# EAGLE design STM32L441CE_4L (EAGLE 9.6.2)

## Sheet 1 of 2
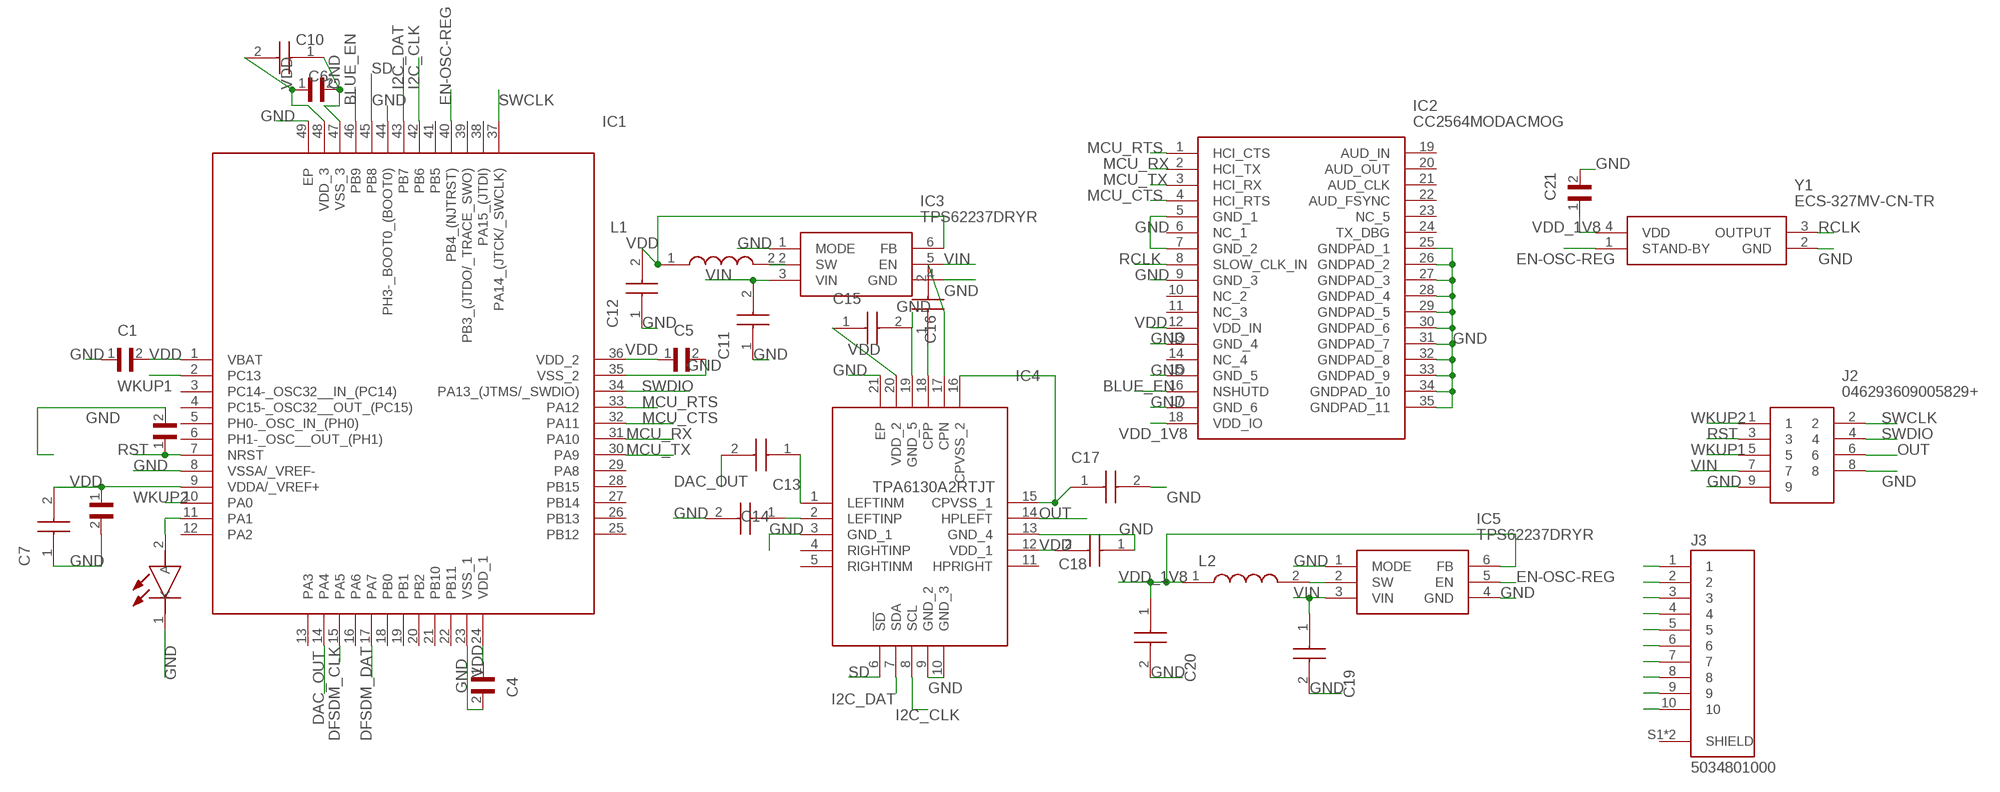
[diagram p0: schematic, sheet 1]

### Parts
C1  GRM033C80J104KE15D  [CAPC0603X33N]
C2  GRM033C80J104KE15D  [CAPC0603X33N]
C3  GRM033C80J104KE15D  [CAPC0603X33N]
C4  GRM033C80J104KE15D  [CAPC0603X33N]
C5  GRM033C80J104KE15D  [CAPC0603X33N]
C6  GRM033C80J104KE15D  [CAPC0603X33N]
C7  AMK063AC6105KP-F  [CAPC0603X33N]
C10  GRM035R60J475ME15D  [CAPC0603X55N]
C11  02016D225MAT2A  [CAPC0603X33N]
C12  GRM035R60J475ME15D  [CAPC0603X55N]
C13  CL03A474KQ3NNNC  [CAPC0603X33N]
C14  CL03A474KQ3NNNC  [CAPC0603X33N]
C15  AMK063AC6105KP-F  [CAPC0603X33N]
C16  AMK063AC6105KP-F  [CAPC0603X33N]
C17  AMK063AC6105KP-F  [CAPC0603X33N]
C18  AMK063AC6105KP-F  [CAPC0603X33N]
C19  02016D225MAT2A  [CAPC0603X33N]
C20  GRM035R60J475ME15D  [CAPC0603X55N]
C21  GRM033C80J104KE15D  [CAPC0603X33N]
IC1  STM32L451CEU6  [QFN50P700X700X60-49N]
IC2  CC2564MODACMOG  [MOG0035A]
IC3  TPS62237DRYR  [SON50P100X145X60-6N]
IC4  TPA6130A2RTJT  [QFN50P400X400X80-21N]
IC5  TPS62237DRYR  [SON50P100X145X60-6N]
J2  046293609005829+  [046293609005829]
J3  5034801000  [MOLEX_5034801000]
L1  MLZ1005M2R2WT000  [INDC1005X55N]
L2  MLZ1005M2R2WT000  [INDC1005X55N]
LED1  VLMS1500-GS08  [VLMG1500GS08]
Y1  ECS-327MV-CN-TR  [ECS327MVCNTR]

### Nets
BLUE_EN: IC1.46(PB9) IC2.16(NSHUTD)
DAC_OUT: C13.2 IC1.14(PA4)
DFSDM_CLK: IC1.15(PA5) ; also sheet 2
DFSDM_DAT: IC1.17(PA7) ; also sheet 2
EN-OSC-REG: IC1.40(PB4_(NJTRST)) IC5.5(EN) Y1.1(STAND-BY)
GND: C1.1 C2.2 C3.2 C4.2 C5.2 C6.2 C7.1 C10.1 C11.1 C12.1 C14.2 C15.2 C17.2 C18.1 C19.2 C20.2 C21.2 IC1.8(VSSA/_VREF-) IC1.23(VSS_1) IC1.35(VSS_2) IC1.44(PH3-_BOOT0_(BOOT0)) IC1.47(VSS_3) IC1.49(EP) IC2.5(GND_1) IC2.7(GND_2) IC2.9(GND_3) IC2.13(GND_4) IC2.15(GND_5) IC2.17(GND_6) IC2.25(GNDPAD_1) IC2.26(GNDPAD_2) IC2.27(GNDPAD_3) IC2.28(GNDPAD_4) IC2.29(GNDPAD_5) IC2.30(GNDPAD_6) IC2.31(GNDPAD_7) IC2.32(GNDPAD_8) IC2.33(GNDPAD_9) IC2.34(GNDPAD_10) IC2.35(GNDPAD_11) IC3.1(MODE) IC3.4(GND) IC4.3(GND_1) IC4.9(GND_2) IC4.10(GND_3) IC4.13(GND_4) IC4.19(GND_5) IC4.21(EP) IC5.1(MODE) IC5.4(GND) J2.8 J2.9 LED1.1(K) Y1.2(GND) ; also sheet 2
I2C_CLK: IC1.42(PB6) IC4.8(SCL)
I2C_DAT: IC1.43(PB7) IC4.7(SDA)
MCU_CTS: IC1.32(PA11) IC2.4(HCI_RTS)
MCU_RTS: IC1.33(PA12) IC2.1(HCI_CTS)
MCU_RX: IC1.31(PA10) IC2.2(HCI_TX)
MCU_TX: IC1.30(PA9) IC2.3(HCI_RX)
N$1: J3.1
N$2: IC3.2(SW) L1.2
N$3: C13.1 IC4.1(LEFTINM)
N$4: C14.1 IC4.2(LEFTINP)
N$5: J3.2
N$6: C16.1 IC4.18(CPP)
N$7: C16.2 IC4.17(CPN)
N$8: C17.1 IC4.15(CPVSS_1) IC4.16(CPVSS_2)
N$9: IC5.2(SW) L2.2
N$10: IC1.11(PA1) LED1.2(A)
N$11: J3.3
N$12: J3.10
N$13: J3.9
N$14: J3.8
N$15: J3.7
N$16: J3.6
N$17: J3.5
N$18: J3.4
OUT: IC4.14(HPLEFT) J2.6
RCLK: IC2.8(SLOW_CLK_IN) Y1.3(OUTPUT)
RST: C2.1 IC1.7(NRST) J2.3
SD: IC1.45(PB8) IC4.6(!SD)
SWCLK: IC1.37(PA14_(JTCK/_SWCLK)) J2.2
SWDIO: IC1.34(PA13_(JTMS/_SWDIO)) J2.4
VDD: C1.2 C3.1 C4.1 C5.1 C6.1 C7.2 C10.2 C12.2 C15.1 C18.2 IC1.1(VBAT) IC1.9(VDDA/_VREF+) IC1.24(VDD_1) IC1.36(VDD_2) IC1.48(VDD_3) IC2.12(VDD_IN) IC3.6(FB) IC4.12(VDD_1) IC4.20(VDD_2) L1.1 ; also sheet 2
VDD_1V8: C20.1 C21.1 IC2.18(VDD_IO) IC5.6(FB) L2.1 Y1.4(VDD)
VIN: C11.2 C19.1 IC3.3(VIN) IC3.5(EN) IC5.3(VIN) J2.7
WKUP1: IC1.2(PC13) J2.5
WKUP2: IC1.10(PA0) J2.1
Unconnected: IC1.3(PC14-_OSC32__IN_(PC14)) IC1.4(PC15-_OSC32__OUT_(PC15)) IC1.5(PH0-_OSC_IN_(PH0)) IC1.6(PH1-_OSC__OUT_(PH1)) IC1.12(PA2) IC1.13(PA3) IC1.16(PA6) IC1.18(PB0) IC1.19(PB1) IC1.20(PB2) IC1.21(PB10) IC1.22(PB11) IC1.25(PB12) IC1.26(PB13) IC1.27(PB14) IC1.28(PB15) IC1.29(PA8) IC1.38(PA15_(JTDI)) IC1.39(PB3_(JTDO/_TRACE_SWO)) IC1.41(PB5) IC2.6(NC_1) IC2.10(NC_2) IC2.11(NC_3) IC2.14(NC_4) IC2.19(AUD_IN) IC2.20(AUD_OUT) IC2.21(AUD_CLK) IC2.22(AUD_FSYNC) IC2.23(NC_5) IC2.24(TX_DBG) IC4.4(RIGHTINP) IC4.5(RIGHTINM) IC4.11(HPRIGHT) J3.S1(SHIELD) J3.S2(SHIELD)

## Sheet 2 of 2
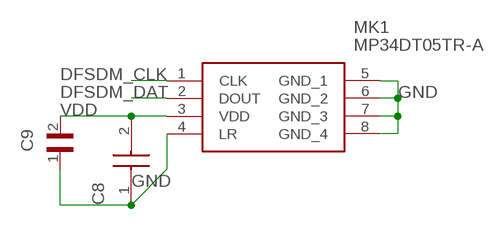
[diagram p1: schematic, sheet 2]

### Parts
C8  AMK063AC6105KP-F  [CAPC0603X33N]
C9  GRM033C80J104KE15D  [CAPC0603X33N]
MK1  MP34DT05TR-A  [MP34DT05TRA]

### Nets
DFSDM_CLK: MK1.1(CLK) ; also sheet 1
DFSDM_DAT: MK1.2(DOUT) ; also sheet 1
GND: C8.1 C9.1 MK1.4(LR) MK1.5(GND_1) MK1.6(GND_2) MK1.7(GND_3) MK1.8(GND_4) ; also sheet 1
VDD: C8.2 C9.2 MK1.3(VDD) ; also sheet 1

## Library data of the parts
C1-C6 C9 C21 = GRM033C80J104KE15D:GRM033C80J104KE15D: .1UF 6.3V 10% 0201; DESCRIPTION: SMD Capacitor X6S(EIA) with Capacitance: 0.10uF Tol. 10%. Rated Voltage: 6.3Vdc; DIGI-KEY_PART_NUMBER: 490-10390-1-ND; DIGIKEY-PURCHASE-URL: https://snapeda.com/shop?store=DigiKey&id=1836969; MF: Murata Electronics; MP: GRM033C80J104KE15D; PACKAGE: 0603 Taiyo Yuden
C7 C8 C15-C18 = AMK063AC6105KP-F:AMK063AC6105KP-F: Multilayer Ceramic Capacitors MLCC - SMD/SMT 0201 4VDC 1uF 10% X6S Source: Datasheet <https://ds.yuden.co.jp/TYCOMPAS/ut/download?pn=LMK063BBJ474MPLF&fileType=CA>; DESCRIPTION: Multilayer Ceramic Capacitors MLCC - SMD/SMT 0201 4VDC 1uF 10% X6S; HEIGHT: 0.33mm; MANUFACTURER_NAME: TAIYO YUDEN; MANUFACTURER_PART_NUMBER: AMK063AC6105KP-F; MOUSER_PART_NUMBER: 963-AMK063AC6105KP-F; MOUSER_PRICE-STOCK: https://www.mouser.com/Search/Refine.aspx?Keyword=963-AMK063AC6105KP-F
C10 C12 C20 = GRM035R60J475ME15D:GRM035R60J475ME15D: Multilayer Ceramic Capacitors MLCC - SMD/SMT 0201 4.7uF 6.3volts *Derate Voltage/Temp Source: Datasheet <https://psearch.en.murata.com/capacitor/product/GRM035R60J475ME15#.pdf>; ARROW_PART_NUMBER: GRM035R60J475ME15D; ARROW_PRICE-STOCK: https://www.arrow.com/en/products/grm035r60j475me15d/murata-manufacturing; DESCRIPTION: Multilayer Ceramic Capacitors MLCC - SMD/SMT 0201 4.7uF 6.3volts *Derate Voltage/Temp; HEIGHT: 0.55mm; MANUFACTURER_NAME: Murata Electronics; MANUFACTURER_PART_NUMBER: GRM035R60J475ME15D; MOUSER_PART_NUMBER: 81-GRM035R60J475ME5D; MOUSER_PRICE-STOCK: https://www.mouser.co.uk/ProductDetail/Murata-Electronics/GRM035R60J475ME15D?qs=I53XXhTNm8vhFCgPvCZ%252BPQ%3D%3D
C11 C19 = 02016D225MAT2A:02016D225MAT2A: Multilayer Ceramic Capacitors MLCC - SMD/SMT 6.3V 2.2uF X5R 0201 20% Tol Source: Datasheet <http://www.mouser.com/catalog/supplier/library/pdf/AVXSurfaceMountCeramic.pdf>; ARROW_PART_NUMBER: 02016D225MAT2A; ARROW_PRICE-STOCK: https://www.arrow.com/en/products/02016d225mat2a/avx; DESCRIPTION: Multilayer Ceramic Capacitors MLCC - SMD/SMT 6.3V 2.2uF X5R 0201 20% Tol; HEIGHT: 0.33mm; MANUFACTURER_NAME: AVX; MANUFACTURER_PART_NUMBER: 02016D225MAT2A; MOUSER_PART_NUMBER: 581-02016D225MAT2A; MOUSER_PRICE-STOCK: https://www.mouser.co.uk/ProductDetail/AVX/02016D225MAT2A?qs=ZBeOGGPQgEHFnviVlXcPQQ%3D%3D
C13 C14 = CL03A474KQ3NNNC:CL03A474KQ3NNNC: CAP CER 0.47UF 6.3V X5R 0201 Source: Datasheet <https://static6.arrow.com/aropdfconversion/f331fa34aa05e23db43dec65c064e91f2185871/19-cl03a474kq3nnnc.pdf>; DESCRIPTION: CAP CER 0.47UF 6.3V X5R 0201; HEIGHT: 0.33mm; MANUFACTURER_NAME: Samsung Electro-Mechanics; MANUFACTURER_PART_NUMBER: CL03A474KQ3NNNC
IC1 = STM32L451CEU6:STM32L451CEU6: MCU 32-bit ARM Cortex M4 RISC 512KB Flash 3.3V 48-Pin UFQFPN Tray Source: Datasheet <https://www.arrow.com/en/products/stm32l451ceu6/stmicroelectronics>; ARROW_PART_NUMBER: STM32L451CEU6; ARROW_PRICE-STOCK: https://www.arrow.com/en/products/stm32l451ceu6/stmicroelectronics; DESCRIPTION: MCU 32-bit ARM Cortex M4 RISC 512KB Flash 3.3V 48-Pin UFQFPN Tray; HEIGHT: 0.6mm; MANUFACTURER_NAME: STMicroelectronics; MANUFACTURER_PART_NUMBER: STM32L451CEU6; MOUSER_PART_NUMBER: 511-STM32L451CEU6; MOUSER_PRICE-STOCK: https://www.mouser.com/Search/Refine.aspx?Keyword=511-STM32L451CEU6
IC2 = CC2564MODACMOG:CC2564MODACMOG: Dual-mode Bluetooth® CC2564 module with integrated antenna Source: Datasheet <http://www.ti.com/lit/ds/symlink/cc2564moda.pdf>; ARROW_PART_NUMBER: CC2564MODACMOG; ARROW_PRICE-STOCK: https://www.arrow.com/en/products/cc2564modacmog/texas-instruments; DESCRIPTION: Dual-mode Bluetooth&#174; CC2564 module with integrated antenna; HEIGHT: mm; MANUFACTURER_NAME: Texas Instruments; MANUFACTURER_PART_NUMBER: CC2564MODACMOG; MOUSER_PART_NUMBER: 595-CC2564MODACMOG; MOUSER_PRICE-STOCK: https://www.mouser.co.uk/ProductDetail/Texas-Instruments/CC2564MODACMOG?qs=tCMd4XlZ%2FiD0qx2OJWZ%2FcQ%3D%3D
IC3 IC5 = TPS62237DRYR:TPS62237DRYR: 2 MHz Ultra Small Step Down Converter with DCS-Control in 1x1.5 SON Package Source: Datasheet <http://www.ti.com/lit/gpn/TPS62230>; ARROW_PART_NUMBER: TPS62237DRYR; ARROW_PRICE-STOCK: https://www.arrow.com/en/products/tps62237dryr/texas-instruments; DESCRIPTION: 2 MHz Ultra Small Step Down Converter with DCS-Control in 1x1.5 SON Package; HEIGHT: 0.6mm; MANUFACTURER_NAME: Texas Instruments; MANUFACTURER_PART_NUMBER: TPS62237DRYR; MOUSER_PART_NUMBER: 595-TPS62237DRYR; MOUSER_PRICE-STOCK: https://www.mouser.co.uk/ProductDetail/Texas-Instruments/TPS62237DRYR?qs=%2Fqzd9s%252BcLd6Amw0z%252Byi3sQ%3D%3D
IC4 = TPA6130A2RTJT:TPA6130A2RTJT: Texas Instruments TPA6130A2RTJT Headphone Audio Amplifier, Class-AB Mono/Stereo 68dB, 20-Pin QFN Source: Datasheet <http://www.ti.com/lit/ds/symlink/tpa6130a2.pdf>; ARROW_PART_NUMBER: TPA6130A2RTJT; ARROW_PRICE-STOCK: https://www.arrow.com/en/products/tpa6130a2rtjt/texas-instruments; DESCRIPTION: Texas Instruments TPA6130A2RTJT Headphone Audio Amplifier, Class-AB Mono/Stereo 68dB, 20-Pin QFN; HEIGHT: 0.8mm; MANUFACTURER_NAME: Texas Instruments; MANUFACTURER_PART_NUMBER: TPA6130A2RTJT; MOUSER_PART_NUMBER: 595-TPA6130A2RTJT; MOUSER_PRICE-STOCK: https://www.mouser.co.uk/ProductDetail/Texas-Instruments/TPA6130A2RTJT?qs=7kv20MEVUlhbnsEmMhzkWg%3D%3D
J2 = 046293609005829+:046293609005829+: FFC & FPC Connectors 9P 0.3mm RA SMD Dual Sided Contact Source: Datasheet <https://www.mouser.com/datasheet/2/909/6293-1381189.pdf>; DESCRIPTION: FFC & FPC Connectors 9P 0.3mm RA SMD Dual Sided Contact; HEIGHT: 1.54mm; MANUFACTURER_NAME: Kyocera Electronic Components; MANUFACTURER_PART_NUMBER: 046293609005829+; MOUSER_PART_NUMBER: 581-046293609005829+; MOUSER_PRICE-STOCK: https://www.mouser.com/Search/Refine.aspx?Keyword=581-046293609005829%2B
J3 = 5034801000:5034801000: 0.50mm Pitch Easy-On™ BackFlip™ Type FPC Connector, 1.00mm Height, Right Angle, Surface Mount, Dual Contact Style; DESCRIPTION: 10 Position FFC, FPC Connector Contacts, Top and Bottom 0.020 (0.50mm) Surface Mount, Right Angle; DIGI-KEY_PART_NUMBER: WM1389CT-ND; MF: Molex; MP: 5034801000; PACKAGE: None; PURCHASE-URL: https://pricing.snapeda.com/search/part/5034801000/?ref=eda
L1 L2 = MLZ1005M2R2WT000:MLZ1005M2R2WT000: Inductor Power Shielded Multi-Layer 2.2uH 20% 2MHz Ferrite 350mA 715mOhm DCR 0402 T/R Source: Datasheet <https://product.tdk.com/info/en/catalog/datasheets/inductor_commercial_decoupling_mlz1005_en.pdf>; ARROW_PART_NUMBER: MLZ1005M2R2WT000; ARROW_PRICE-STOCK: https://www.arrow.com/en/products/mlz1005m2r2wt000/tdk; DESCRIPTION: Inductor Power Shielded Multi-Layer 2.2uH 20% 2MHz Ferrite 350mA 715mOhm DCR 0402 T/R; HEIGHT: 0.55mm; MANUFACTURER_NAME: TDK; MANUFACTURER_PART_NUMBER: MLZ1005M2R2WT000; MOUSER_PART_NUMBER: 810-MLZ1005M2R2WT000; MOUSER_PRICE-STOCK: https://www.mouser.co.uk/ProductDetail/TDK/MLZ1005M2R2WT000?qs=%2FPzWLGNeQ%252BiWY3SLL2a3ow%3D%3D
LED1 = VLMS1500-GS08:VLMS1500-GS08: Vishay 631 nm Red LED, 1005 (0402) SMD package Source: Datasheet <https://componentsearchengine.com/Datasheets/2/VLMS1500-GS08.pdf>; ARROW_PART_NUMBER: VLMS1500-GS08; ARROW_PRICE-STOCK: https://www.arrow.com/en/products/vlms1500-gs08/vishay; DESCRIPTION: Vishay 631 nm Red LED, 1005 (0402) SMD package; HEIGHT: mm; MANUFACTURER_NAME: Vishay; MANUFACTURER_PART_NUMBER: VLMS1500-GS08; MOUSER_PART_NUMBER: 78-VLMS1500-GS08; MOUSER_PRICE-STOCK: https://www.mouser.co.uk/ProductDetail/Vishay-Semiconductors/VLMS1500-GS08?qs=2BArZ0I3QllOybMBfd%252BobQ%3D%3D
MK1 = MP34DT05TR-A:MP34DT05TR-A: STMICROELECTRONICS - MP34DT05TR-A - MEMS MICROPHONE, 3.6V, HCLGA-4 Source: Datasheet <http://www.st.com/content/ccc/resource/technical/document/datasheet/group3/c7/90/d3/f6/b7/e7/40/c8/DM00415595/files/DM00415595.pdf/jcr:content/translations/en.DM00415595.pdf>; DESCRIPTION: STMICROELECTRONICS - MP34DT05TR-A - MEMS MICROPHONE, 3.6V, HCLGA-4; HEIGHT: 1mm; MANUFACTURER_NAME: STMicroelectronics; MANUFACTURER_PART_NUMBER: MP34DT05TR-A; MOUSER_PART_NUMBER: 511-MP34DT05TR-A; MOUSER_PRICE-STOCK: https://www.mouser.com/Search/Refine.aspx?Keyword=511-MP34DT05TR-A
Y1 = ECS-327MV-CN-TR:ECS-327MV-CN-TR: Standard Clock Oscillators 32.768kHz LVCMOS 1.6-3.6V Source: Datasheet <https://datasheet.datasheetarchive.com/originals/dk/DKDS42/DSANUWW0043417.pdf>; ARROW_PART_NUMBER: ECS-327MV-CN-TR; ARROW_PRICE-STOCK: https://www.arrow.com/en/products/ecs-327mv-cn-tr/ecs-international; DESCRIPTION: Standard Clock Oscillators 32.768kHz LVCMOS 1.6-3.6V; HEIGHT: 0.7mm; MANUFACTURER_NAME: ECS; MANUFACTURER_PART_NUMBER: ECS-327MV-CN-TR; MOUSER_PART_NUMBER: 520-327MV-CNT; MOUSER_PRICE-STOCK: https://www.mouser.co.uk/ProductDetail/ECS/ECS-327MV-CN-TR?qs=MLItCLRbWswJ3OzWTZUbfw%3D%3D

## Board
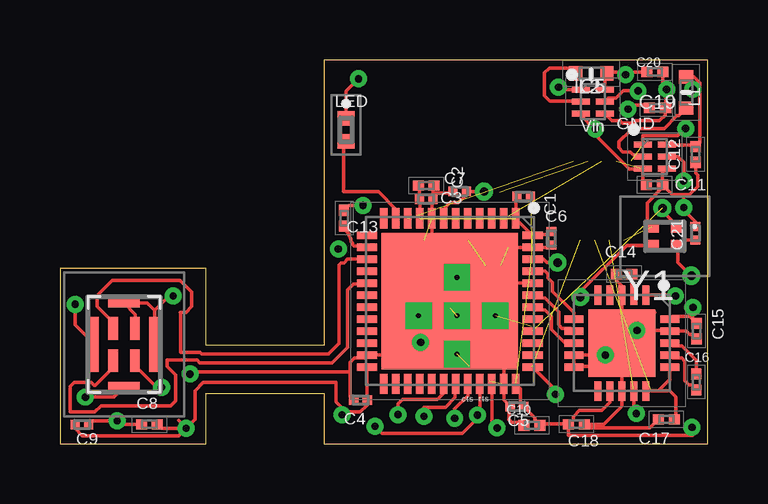
[diagram p2: board, top side]
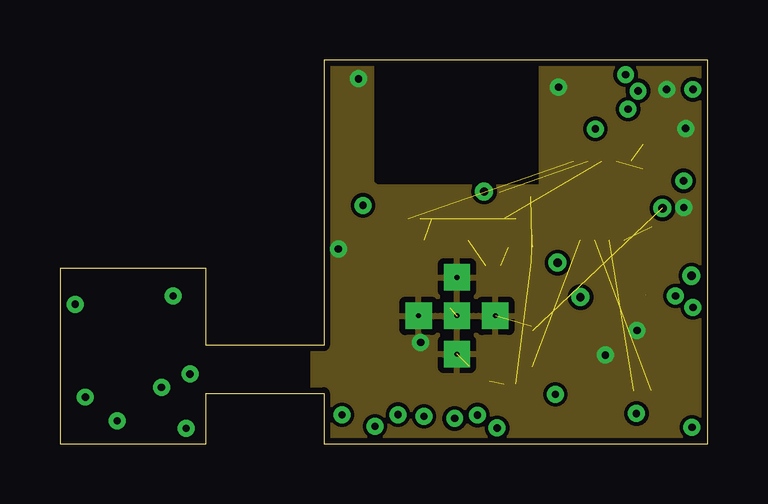
[diagram p3: board, inner layer GND]
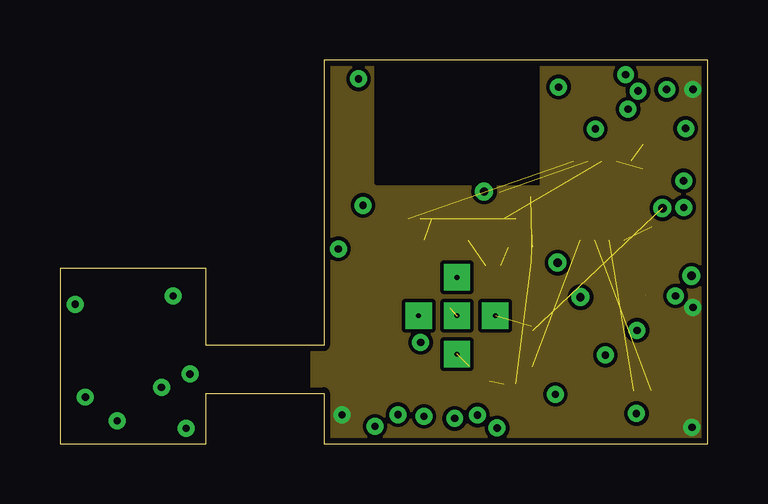
[diagram p4: board, inner layer VDD]
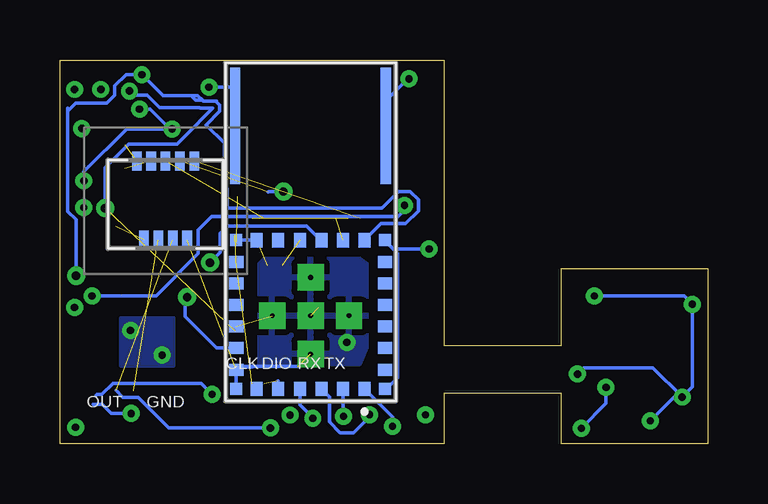
[diagram p5: board, bottom side, seen from below]

Size 27 x 16 mm. Coordinates in mm from the lower left corner, seen from the top.
Outline: 0,0 6.1,0 6.1,2.1 11,2.1 11,0 27,0 27,16 11,16 11,4.1 6.1,4.1 6.1,7.31 0,7.31 0,0
Copper layers ([2:[15:1+2*15+16]]): Top 0.035mm / dielectric 1.5mm / GND 0.035mm / dielectric 0.15mm / VDD 0.035mm / dielectric 0.2mm / Bottom 0.035mm
Design rules "default *": minimum track width 6mil, minimum drill 0.3mm, track to track 6mil, track to pad 6mil, pad to pad 6mil, via to via 6mil, smd to smd 6mil, copper to edge 10mil, drill to drill 0.3mm, minimum pad ring 10mil, minimum via ring 8mil, stop-mask expansion 4mil, vias tented up to drill 0mil, thermal gap 10mil

### Footprints (pad centres in the part's own frame; a part is rotated, then mirrored left to right if it is on the bottom)
CAPC0603X33N = smd 0.38 x 0.4: 1 -0.281,0; 2 0.281,0
CAPC0603X33N' = smd 0.46 x 0.42: 1 -0.33,0; 2 0.33,0
CAPC0603X55N = smd 0.465 x 0.44: 1 -0.332,0; 2 0.332,0
CAPC0603X33N'' = smd 0.47 x 0.44: 1 -0.335,0; 2 0.335,0
QFN50P700X700X60-49N = smd 0.85 x 0.3: 1 -3.45,2.75; 2 -3.45,2.25; 3 -3.45,1.75; 4 -3.45,1.25; 5 -3.45,0.75; 6 -3.45,0.25; 7 -3.45,-0.25; 8 -3.45,-0.75; 9 -3.45,-1.25; 10 -3.45,-1.75; 11 -3.45,-2.25; 12 -3.45,-2.75; 25 3.45,-2.75; 26 3.45,-2.25; 27 3.45,-1.75; 28 3.45,-1.25; 29 3.45,-0.75; 30 3.45,-0.25; 31 3.45,0.25; 32 3.45,0.75; 33 3.45,1.25; 34 3.45,1.75; 35 3.45,2.25; 36 3.45,2.75 | smd 0.3 x 0.85: 13 -2.75,-3.45; 14 -2.25,-3.45; 15 -1.75,-3.45; 16 -1.25,-3.45; 17 -0.75,-3.45; 18 -0.25,-3.45; 19 0.25,-3.45; 20 0.75,-3.45; 21 1.25,-3.45; 22 1.75,-3.45; 23 2.25,-3.45; 24 2.75,-3.45; 37 2.75,3.45; 38 2.25,3.45; 39 1.75,3.45; 40 1.25,3.45; 41 0.75,3.45; 42 0.25,3.45; 43 -0.25,3.45; 44 -0.75,3.45; 45 -1.25,3.45; 46 -1.75,3.45; 47 -2.25,3.45; 48 -2.75,3.45 | smd 5.7 x 5.7: 49 0,0
MOG0035A = smd 0.6 x 0.5: 1 -6.55,-2.25; 2 -6.55,-1.35; 3 -6.55,-0.45; 4 -6.55,0.45; 5 -6.55,1.35; 6 -6.55,2.25; 13 -0.35,2.25; 14 -0.35,1.35; 15 -0.35,0.45; 16 -0.35,-0.45; 17 -0.35,-1.35; 18 -0.35,-2.25 | smd 0.5 x 0.6: 7 -5.75,3.1; 8 -4.85,3.1; 9 -3.95,3.1; 10 -3.05,3.1; 11 -2.15,3.1; 12 -1.25,3.1; 19 -1.25,-3.1; 20 -2.15,-3.1; 21 -3.05,-3.1; 22 -3.95,-3.1; 23 -4.85,-3.1; 24 -5.75,-3.1 | drill 0.2 pad 1.1 square: 25 -5.1,0; 26 -3.5,1.6; 27 -3.5,0; 28 -3.5,-1.6; 29 -1.9,0 | smd 0.5 x 0.5: 30 -6.55,-3.1; 31 -6.55,3.1; 32 -0.35,3.1; 33 -0.35,-3.1 | smd 4.85 x 0.43: 34 4.425,-3.135; 35 4.425,3.15
SON50P100X145X60-6N = smd 0.75 x 0.25: 1 -0.5,0.5; 2 -0.5,0; 3 -0.5,-0.5; 4 0.5,-0.5; 5 0.5,0; 6 0.5,0.5
QFN50P400X400X80-21N = smd 0.8 x 0.3: 1 -2,1; 2 -2,0.5; 3 -2,0; 4 -2,-0.5; 5 -2,-1; 11 2,-1; 12 2,-0.5; 13 2,0; 14 2,0.5; 15 2,1 | smd 0.3 x 0.8: 6 -1,-2; 7 -0.5,-2; 8 0,-2; 9 0.5,-2; 10 1,-2; 16 1,2; 17 0.5,2; 18 0,2; 19 -0.5,2; 20 -1,2 | smd 2.8 x 2.8: 21 0,0
046293609005829 = smd 0.4 x 0.8: 1 -1.2,-1.65; 2 -0.9,1.65; 3 -0.6,-1.65; 4 -0.3,1.65; 5 0,-1.65; 6 0.3,1.65; 7 0.6,-1.65; 8 0.9,1.65; 9 1.2,-1.65
MOLEX_5034801000 = smd 0.3 x 0.7: 1 -2.25,0; 2 -1.75,0; 3 -1.25,0; 4 -0.75,0; 5 -0.25,0; 6 0.25,0; 7 0.75,0; 8 1.25,0; 9 1.75,0; 10 2.25,0 | smd 0.3 x 1: S1 -3.04,-2.65; S2 3.04,-2.65
INDC1005X55N = smd 0.55 x 0.6: 1 -0.65,0; 2 0.65,0
VLMG1500GS08 = smd 0.6 x 0.7: 1 -0.475,0; 2 0.475,0
MP34DT05TRA = smd 0.4 x 0.95: 1 -0.45,0.675; 2 -0.45,-0.675; 3 0.45,-0.675; 4 0.45,0.675 | smd 0.35 x 2.3: 5 -1.225,0; 6 1.225,0 | smd 1.3 x 0.35: 7 0,1.725; 8 0,-1.725
ECS327MVCNTR = smd 0.6 x 0.5: 1 -0.55,-0.4; 2 0.55,-0.4; 3 0.55,0.4; 4 -0.55,0.4

### Placement (x,y rotation side)
C1  19.33,10.31 180 top
C2  16.66,10.52 180 top
C3  15.27,10.19 0 top
C4  12.53,1.82 180 top
C5  19.05,1.55 180 top
C6  20.49,8.56 270 top
C7  AMK063AC6105KP-F  [CAPC0603X33N']  15.27,10.76 180 top
C8  AMK063AC6105KP-F  [CAPC0603X33N']  3.73,0.81 0 top
C9  0.92,0.8 180 top
C10  19.68,0.76 0 top
C11  02016D225MAT2A  [CAPC0603X33N'']  24.79,10.79 180 top
C12  26.5,12.06 90 top
C13  CL03A474KQ3NNNC  [CAPC0603X33N']  11.85,9.4 270 top
C14  CL03A474KQ3NNNC  [CAPC0603X33N']  23.52,7.07 180 top
C15  AMK063AC6105KP-F  [CAPC0603X33N']  26.54,4.69 270 top
C16  AMK063AC6105KP-F  [CAPC0603X33N']  26.53,2.57 270 top
C17  AMK063AC6105KP-F  [CAPC0603X33N']  25.28,1.01 180 top
C18  AMK063AC6105KP-F  [CAPC0603X33N']  21.53,0.81 180 top
C19  02016D225MAT2A  [CAPC0603X33N'']  24.91,14 0 top
C20  24.8,15.5 0 top
C21  26.49,8.77 90 top
IC1  16.25,5.94 270 top
IC2  16.55,8.83 90 bottom
IC3  24.8,11.97 0 top
IC4  23.43,4.19 270 top
IC5  22.21,14.26 0 top
J2  22.6,10.13 180 bottom
J3  38.2,8.94 270 top  (outside the outline)
L1  26.11,14.64 270 top
L2  22.15,15.43 180 top
LED1  11.93,13.08 270 top
MK1  2.67,4.13 0 top
Y1  25.22,8.65 180 top

### Tracks (layer width: path | path; a pad name or v marks a point on that pad's centre or on a via)
BLUE_EN  (via drill 0.35)
  Top 0.152: IC1.46 20.16,7.69 20.3,7.55 v20.75,7.55
  Bottom 0.152: v20.75,7.55 20.32,7.97 20.32,8.77 20,9.08 16.73,9.08 16.13,8.48 IC2.16
DAC_OUT
  Top 0.152: C13.2 12.12,8.53 12.12,8.43 12.19,8.36 12.19,8.3 12.25,8.23 12.75,8.23 IC1.14
DFSDM_CLK
  Top 0.152: MK1.1 2.22,5.05 1.56,5.71 1.56,6.18 2.18,6.8 5.01,6.8 5.49,6.31 5.49,5.71 5.25,5.47 5.02,5.47 5.03,5.46 5.03,3.79 5.84,3.79 5.9,3.73 11.2,3.73 11.64,4.17 11.64,7.45 11.73,7.54 11.85,7.54 12,7.69 IC1.15
DFSDM_DAT
  Top 0.152: IC1.17 12.78,6.66 12.24,6.66 11.99,6.41 11.99,4.01 11.35,3.37 5.83,3.37 5.71,3.49 4.47,3.49 4.47,3.22 4.82,2.87 4.82,1.79 4.61,1.58 1.71,1.58 1.45,1.32 0.43,1.32 0.43,2.38 0.59,2.54 1.31,2.54 1.43,2.43 1.47,2.43 2.22,3.17 MK1.2
EN-OSC-REG  (via drill 0.3, 0.35)  (1 unrouted)
  Top 0.152: IC5.5 22.86,14.41 23.18,14.41 23.48,14.71 v24.1,14.71 v24.11,14.71 | 25.12,9.59 v25.12,9.82 25.12,9.7 Y1.1
  Bottom 0.152: v24.11,14.71 23.93,14.53 23.36,14.53 22.84,14.01 21.18,14.01 21.16,13.98 20.64,13.98 21.79,12.83 | 21.79,12.83 | 21.79,12.83 22.12,12.5 24.14,12.5 25.12,11.52 v25.12,9.82
GND  (via drill 0.3)  (11 unrouted)
  Top 0.152: IC4.13 23.43,1.56 22.68,0.81 C18.1 22.01,0.66 24.6,0.66 C17.2 | 15.46,10.1 C3.2 | IC1.44 17,6.69 | 18.68,8.17 19.68,8.17 IC1.47 19.84,8.19 19.85,8.18 20.39,8.18 C6.2 | 18.02,7.42 16.77,7.42 15.52,8.67 15.52,6.89 16.36,6.05 | 18.37,7.42 18.37,8.33 16.25,6.21 | 16.25,6.21 13.73,3.69 IC1.23 12.68,3.57 12.28,3.57 12.1,3.39 12.1,1.97 | IC1.49 18.5,3.69 IC1.35 18.5,1.82 C5.2 18.72,1.5 18.72,0.99 18.74,0.99 18.85,0.89 19.22,0.89 C10.1 | 12.1,1.97 C4.2 12.1,1.97 | 21.43,3.23 21.43,3.6 IC4.9 v22.74,3.69 | 23.43,4.72 23.43,4.22 IC4.21 | 23.43,4.72 23.43,5.35 | 23.43,5.35 23.43,6.1 IC4.3 23.42,6.58 23.19,6.8 C14.2 | 23.43,5.35 v24.06,4.72 | v24.06,4.72 23.26,3.92 23.26,3.73 | 24.68,4.72 25.31,4.72 IC4.19 26.11,4.69 26.23,4.56 26.34,4.56 C15.2 | 23.43,4.72 23.43,4.25 | 23.43,4.25 IC4.21 | 23.43,3.23 23.43,4.1 IC4.21 | 23.43,3.23 23.43,2.23 IC4.13 | 23.43,3.23 21.43,3.23 | 21.43,3.23 IC4.10 | 23.43,3.23 23.43,3.75 IC4.21 | 24.81,5.47 24.68,5.35 24.68,4.72 | 24.68,4.72 IC4.21 | 12.1,1.97 12.1,2.98 5.5,2.98 v5.42,2.9 | 17,6.69 17.73,7.42 | IC1.49 16.25,5.66 | IC1.49 16.15,5.94 14.78,7.31 | IC4.21 22.87,4.75 22.76,4.75 | IC1.49 16.25,6.21 | IC1.49 16.36,6.05 | 16.36,6.05 16.51,6.2 | 16.51,6.2 17,6.69 | 3.94,5.17 3.9,5.21 MK1.6 3.95,4.18 3.95,5.54 | 3.95,5.54 3.64,5.86 MK1.7 3.13,5.39 3.13,4.82 MK1.4 | 3.95,5.54 4.56,6.16 v4.72,6.16 | v0.63,5.81 0.63,4.94 MK1.5 | MK1.8 2.67,2.35 2.26,1.94 v1.06,1.94 | C9.1 1.34,0.94 v2.39,0.94 2.52,0.81 C8.1 | IC4.13 23.43,4.25 | 23.43,4.25 | IC5.4 23.01,13.46 23.35,13.46 23.45,13.37 23.93,13.37 24.02,13.46 25,13.46 25.25,13.71 C19.2 25.25,14.81 v25.29,14.77 25.13,14.93 C20.2 | IC5.1 20.9,14.76 v20.79,14.87
  Top 0.152: C12.1 26.5,11.28 26.58,11.2 26.58,10.72 26.24,10.38 26.01,10.38 | IC3.1 24.3,12.84 25.77,12.84 v26.08,13.15 v26.09,13.14 | 26.01,10.38 v26.01,9.85 26.01,9.74 26.49,9.26 C21.2 | C3.2 15.55,10.45 15.56,10.45 | 15.56,10.45 15.56,10.72 C7.1 | 15.51,10.15 C3.2 | C3.2 15.5,10.14 IC1.8 15.5,7.21 16.51,6.2 | C2.2 16.31,10.45 15.56,10.45 | LED1.1 11.93,14.69 v12.45,15.21 | 25.27,10.64 25.53,10.38 26.01,10.38 | 25.27,10.64 C11.1 25.12,11.29 IC3.4 | Y1.2 24.48,9.24 24.48,10.04 25.08,10.64 25.27,10.64 | v22.74,3.69 22.87,3.69 23.43,4.25 | IC4.21 23.96,4.72 v24.06,4.72 | IC4.21 22.93,3.69 v22.74,3.69
  Bottom 0.152: v4.72,6.16 0.98,6.16 v0.63,5.81 0.63,2.37 v1.06,1.94 | v2.39,0.94 1.4,1.94 v1.06,1.94 | v5.42,2.9 5.16,3.16 2.28,3.16 v1.06,1.94 | IC2.7 19.53,3.2 18.97,3.2 | IC2.31 IC2.7 | IC2.32 IC2.13 | 13.45,15.41 13.41,15.38 IC2.34 13.41,14.29 12.5,15.21 v12.45,15.21 | IC2.30 13.38,2.28 12.92,2.73 12.92,7.92 13.45,8.45 IC2.33 13.09,8.12 v11.61,8.12 | IC2.7 19.52,3.21 17.07,3.21 | IC2.5 17.9,2.62 | v20.79,14.87 19.77,14.87 | 19.77,14.87 19.71,14.93 | IC2.35 19.7,14.8 19.77,14.87
  other vias: 15.04,4.22
  pour Bottom: 14.5,7.71 18.5,7.71 18.7,7.51 18.7,3.3 14.5,3.3 14.2,4.01 14.2,7.51
  pour GND: 10.5,16 12.96,16 13.04,15.92 13.04,10.9 13.21,10.73 19.99,10.73 20.04,10.78 20.04,15.82 19.97,15.89 27.5,16 27.5,-0.5 10.5,-0.5
  pour Bottom: 22.26,5.24 24.46,5.24 24.46,3.24 22.26,3.24
I2C_CLK
  Top 0.152: IC4.8 21.26,4.19 21.06,4.19 20.5,4.75 20.5,5.29 20.22,5.57 19.82,5.57 IC1.42
I2C_DAT
  Top 0.152: IC1.43 19.82,6.07 20.22,6.07 20.8,5.49 20.8,4.95 20.93,4.81 21.31,4.81 IC4.7
MCU_CTS  (via drill 0.3)
  Top 0.152: IC1.32 17,2 16.46,1.46 v16.46,1.05
  Bottom 0.152: v16.46,1.05 16.46,1.07 17,1.61 IC2.4
MCU_RTS  (via drill 0.3)
  Top 0.152: IC1.33 17.5,1.28 v17.41,1.19 17.41,1.05 16.79,0.43 13.43,0.43 v13.14,0.72
  Bottom 0.152: IC2.1 13.14,1.12 v13.14,0.72
MCU_RX  (via drill 0.3)
  Top 0.152: 16.5,2.4 IC1.31 16.48,2.47 16.48,1.92 16.07,1.51 15.18,1.51 v15.18,1.14
  Bottom 0.152: v15.18,1.14 15.2,1.16 IC2.2
MCU_TX  (via drill 0.3)
  Top 0.152: IC1.30 16,2.09 15.74,1.84 14.28,1.84 14.09,1.65 v14.09,1.21
  Bottom 0.152: IC2.3 15.77,1.95 15.77,0.9 15.31,0.44 14.76,0.44 14.09,1.11 v14.09,1.21
N$2
  Top 0.152: IC3.2 23.98,11.97 23.79,12.15 23.47,12.15 23.3,12.33 23.3,12.59 23.77,13.06 24.05,13.06 24.14,13.14 25.19,13.14 25.73,13.68 25.8,13.68 L1.2
N$3  (via drill 0.3)  (1 unrouted)
  Top 0.152: v12.64,9.94 12.05,9.94 C13.1 | IC4.1 24.36,6.2 | v25.66,6.16 25.64,6.19 IC4.1
  Bottom 0.152: v12.64,9.94 12.64,9.73 12.9,9.47 20.68,9.47 21.24,8.91 21.24,7.92 23,6.16 v25.66,6.16
N$4
  Top 0.152: IC4.2 23.85,6.27 C14.1
N$6
  Top 0.152: IC4.18 25.55,4.07 25.93,4.07 26.53,3.46 C16.1
N$7
  Top 0.152: C16.2 26.33,2.44 26.23,2.44 26.06,2.61 26.06,3.44 25.93,3.57 25.55,3.57 IC4.17
N$8
  Top 0.152: IC4.16 25.43,2.65 25.41,2.65 24.95,2.19 IC4.15 25.43,2.19 25.67,1.95 25.67,1.07 C17.1
N$9
  Top 0.152: IC5.2 21.69,14.28 20.43,14.28 20.2,14.51 20.2,15.46 20.4,15.66 21.27,15.66 L2.2
N$10
  Top 0.152: IC1.11 14,9.79 13.27,10.52 11.83,10.52 11.83,12.51 LED1.2
OUT  (via drill 0.3)  (1 unrouted)
  Top 0.152: IC4.14 23.93,1.36 v24.04,1.25
  Bottom 0.152: v24.04,1.25 24.86,1.25 25.24,1.64 25.61,1.64
RCLK  (via drill 0.35)
  Top 0.152: Y1.3 24.65,8.27 23.62,8.27 21.7,6.34 v21.7,6.11
  Bottom 0.152: IC2.8 20.47,3.98 21.79,5.3 21.79,6.02 v21.7,6.11
RST  (via drill 0.35)  (1 unrouted)
  Top 0.152: 16,9.44 IC1.7 16,9.79 16.25,10.04 16.62,10.04 16.94,10.37 C2.1 v17.67,10.52 v17.68,10.51
  Bottom 0.152: v17.68,10.51 18.3,10.51 18.33,10.48
SD
  Top 0.152: IC4.6 21.43,5.46 20.54,6.35 20.54,6.72 20.35,6.9 20.35,7.06 20.23,7.19 IC1.45
SWCLK  (via drill 0.3)  (1 unrouted)
  Top 0.152: IC1.37 20.66,2.23 v20.66,2.05
  Bottom 0.152: 25.49,2.01 25.45,2.05 25.25,2.05 24.79,2.52 21.12,2.52 v20.66,2.05
SWDIO  (via drill 0.3)  (1 unrouted)
  Top 0.152: IC1.34 18,0.88 v18.23,0.65
  Bottom 0.152: 18.21,0.67 v18.23,0.65 22.47,0.65 23.75,1.93 24.38,1.93 24.66,2.21
VDD  (via drill 0.3)  (3 unrouted)
  Top 0.152: IC1.36 19.2,2.29 19.2,1.57 19.35,1.57 | 19.35,1.57 C5.1 | IC4.12 22.93,1.71 22.6,1.38 21.66,1.38 21.4,1.11 21.4,1.01 C18.2 | IC1.9 C3.1 | C1.2 19,10.11 IC1.1 19,9.36 19.62,8.73 IC1.48 19.72,8.71 20.36,8.71 C6.1 | IC1.24 C4.1 12.81,1.59 12.51,1.33 11.92,1.33 11.76,1.49 | 25.43,5.22 IC4.20 25.53,5.29 26.27,5.29 C15.1 26.39,5.17 v26.39,5.67 | 26.35,0.57 v26.35,0.68 26.39,0.63 26.39,0.35 21.2,0.35 C18.2 | C3.1 | MK1.3 3.12,3.26 4.04,2.34 v4.23,2.34 | 4.94,0.96 v5.26,0.64 | C9.2 0.64,0.63 0.94,0.33 4.95,0.33 v5.26,0.64 | v5.26,0.64 5.63,1.01 5.63,2.21 5.97,2.55 11.5,2.55 11.5,1.75 11.76,1.49 | 26.67,14.71 26.67,15.06 26.44,15.29 L1.1 | 26.67,14.71 26.67,14.62 | 26.67,14.62 26.67,12.56 C12.2 26.44,12.45 25.32,12.45 IC3.6 | C18.2 21.2,0.83 20.08,0.83 C10.2 19.81,0.96 19.81,1.07 19.35,1.53 19.35,1.57 | v5.26,0.64 4.23,0.64 C8.2 | C3.1 14.99,10.71 C7.2 | 11.76,1.49 v11.76,1.2 | 26.67,14.62 26.54,14.62 | 26.67,14.71 26.48,14.71 26.42,14.77 v26.39,14.77
  Bottom 0.152: v5.26,0.64 4.23,1.67 v4.23,2.34
  pour VDD: 10.5,16 12.93,16 13.03,15.9 13.03,10.82 13.15,10.7 20.08,10.7 20.08,15.76 19.98,15.86 27.5,16 27.5,-0.5 10.5,-0.5
VDD_1V8  (via drill 0.3, 0.35)
  Top 0.152: IC5.6 22.71,15.34 L2.1 22.85,15.48 23.45,15.48 | C20.1 23.43,15.5 23.45,15.48 | 23.45,15.48 23.54,15.39 v23.58,15.39 | C21.1 26.01,8.49 Y1.4 25.77,7.55 v26.32,7 v26.33,7
  Bottom 0.152: 20.46,14.28 20.47,14.29 20.51,14.29 | 21.54,14.51 22.7,14.51 v23.58,15.39 24.25,15.39 24.71,14.92 24.71,14.53 25.05,14.19 26.34,14.19 26.67,13.86 | 21.54,14.51 21.25,14.51 21.06,14.31 | IC2.18 13.61,9.17 12.59,9.17 12.06,9.69 12.06,10.18 12.4,10.52 12.88,10.52 13.57,9.83 20.04,9.83 20.04,10.63 20.14,10.73 20.14,12.52 20.91,13.29 20.34,13.86 20.34,14.11 20.51,14.29 | 20.51,14.29 21.03,14.29 21.06,14.31 | 21.06,14.31 21.34,14.31 21.54,14.51 | v26.33,7 26.33,9.34 26.67,9.68 26.67,13.86 | 26.67,13.86 26.67,13.98
VIN  (via drill 0.3)  (1 unrouted)
  Top 0.152: IC3.5 25.77,11.97 26,11.74 v26,10.96 | 24.55,13.98 C19.1 24.46,14.11 23.85,14.11 v23.69,13.95 | IC5.3 21.71,13.69 22.28,13.12 v22.32,13.12 22.45,12.99 22.45,12.74 23.74,11.45 24.28,11.45 IC3.3 24.3,10.94 C11.2
  Bottom 0.152: v26,10.96 26,11.33 24.21,13.12 v22.32,13.12 22.41,13.12 23.24,13.95 v23.69,13.95
WKUP1  (1 unrouted)
WKUP2  (1 unrouted)

### Text on the board
tNames: LED | Vin | GND | cts | rts
bNames: TX | RX | DIO | CLK | GND | OUT